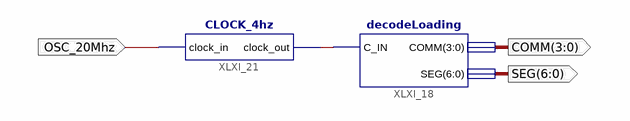
[diagram p0: schematic sheet 1]
// Xilinx ISE schematic Loading7Seg.sch (spartan6) as structural Verilog: 2 symbols, 3 ports
module Loading7Seg (
  input  OSC_20Mhz,
  output [3:0] COMM,
  output [6:0] SEG
);

  wire XLXN_21;

  decodeLoading XLXI_18 (.C_IN(XLXN_21), .COMM(COMM), .SEG(SEG));
  CLOCK_4hz XLXI_21 (.clock_in(OSC_20Mhz), .clock_out(XLXN_21));
endmodule
